# Altium schematic sheet Main_Board_Schematic.SchDoc
size A4; SheetNumber: 5; SheetTotal: 8
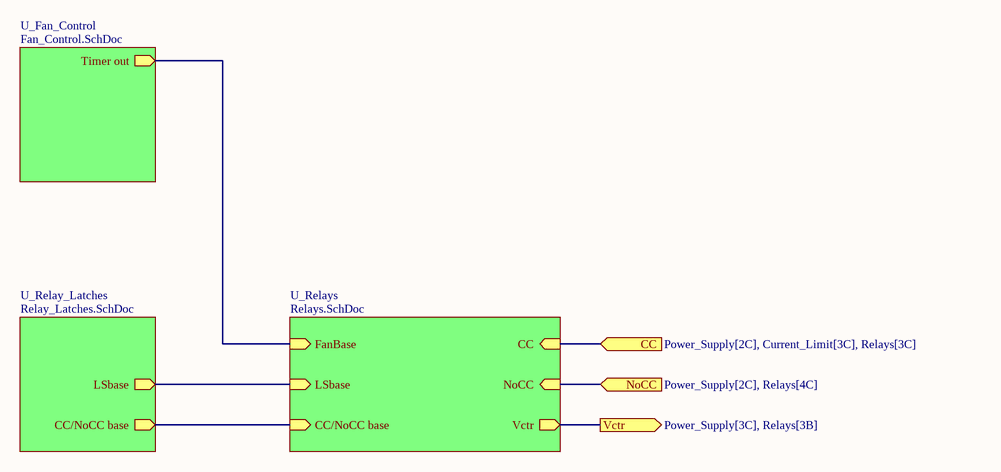
[diagram p0: Main_Board_Schematic.SchDoc]

## Sub-sheets
U_Fan_Control = Fan_Control.SchDoc: Timer out (out)
U_Relay_Latches = Relay_Latches.SchDoc: LSbase (out), CC/NoCC base (out)
U_Relays = Relays.SchDoc: CC/NoCC base (in), LSbase (in), FanBase (in), CC (in), NoCC (in), Vctr (out)

## Ports
CC (in, see Power_Supply[2C], Current_Limit[3C], Relays[3C]), NoCC (in, see Power_Supply[2C], Relays[4C]), Vctr (out, see Power_Supply[3C], Relays[3B])

## Nets
CC: port CC, sheet U_Relays/CC
NoCC: port NoCC, sheet U_Relays/NoCC
Vctr: port Vctr, sheet U_Relays/Vctr
(unnamed): sheet U_Relay_Latches/LSbase, sheet U_Relays/LSbase
(unnamed): sheet U_Relay_Latches/CC/NoCC base, sheet U_Relays/CC/NoCC base
(unnamed): sheet U_Relays/FanBase, sheet U_Fan_Control/Timer out